# EAGLE design pumpkin (EAGLE 5.09)
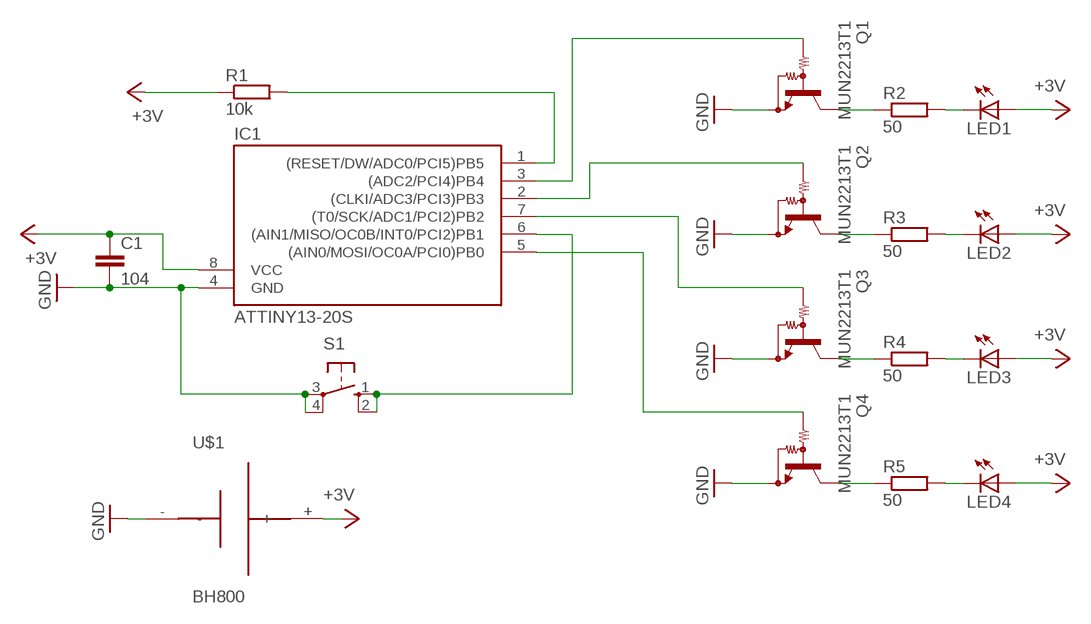
[diagram p0: schematic, sheet 1]

## Parts
C1  104  C-EUC2012  [C2012]
IC1  ATTINY13-20S  [SOIC8]
LED1  LED3MM  [LED3MM]
LED2  LED3MM  [LED3MM]
LED3  LED3MM  [LED3MM]
LED4  LED3MM  [LED3MM]
Q1  MUN2213T1  [SC59-BEC]
Q2  MUN2213T1  [SC59-BEC]
Q3  MUN2213T1  [SC59-BEC]
Q4  MUN2213T1  [SC59-BEC]
R1  10k  R-EU_0204/5  [0204/5]
R2  50  R-EU_0204/5  [0204/5]
R3  50  R-EU_0204/5  [0204/5]
R4  50  R-EU_0204/5  [0204/5]
R5  50  R-EU_0204/5  [0204/5]
S1  10-XX  [B3F-10XX]
U$1  BH800  [BH800]

## Nets
+5V: C1.1 IC1.8(VCC) LED1.A LED2.A LED3.A LED4.A R1.1 U$1.+ ; supply symbol labelled +3V
GND: C1.2 IC1.4(GND) Q1.E Q2.E Q3.E Q4.E S1.3(P) S1.4(P1) U$1.-
N$1: Q1.C R2.1
N$2: Q2.C R3.1
N$3: Q3.C R4.1
N$4: Q4.C R5.1
N$5: IC1.3((ADC2/PCI4)PB4) Q1.B
N$6: LED1.K(C) R2.2
N$7: IC1.2((CLKI/ADC3/PCI3)PB3) Q2.B
N$8: LED2.K(C) R3.2
N$9: LED3.K(C) R4.2
N$10: IC1.1((RESET/DW/ADC0/PCI5)PB5) R1.2
N$11: LED4.K(C) R5.2
N$12: IC1.7((T0/SCK/ADC1/PCI2)PB2) Q3.B
N$13: IC1.5((AIN0/MOSI/OC0A/PCI0)PB0) Q4.B
N$14: IC1.6((AIN1/MISO/OC0B/INT0/PCI2)PB1) S1.1(S) S1.2(S1)

## Library data of the parts
C1 = rcl:C-EU: CAPACITOR, European symbol
IC1 = avr:ATTINY13: MICROCONTROLLER 1 Kbytes FLASH 64 bytes EEPROM 64 bytes RAM 4-channel 10 bit ADC
LED1-LED4 = led:LED: LED OSRAM: - CHIPLED LG R971, LG N971, LY N971, LG Q971, LY Q971, LO R971, LY R971 LH N974, LH R974 LS Q976, LO Q976, LY Q976 LO Q996 - Hyper CHIPLED LW Q18S LB Q993, LB Q99A, LB R99A - SideLED LS A670, LO A670, LY A670, LG A670, LP A670 LB A673, LV A673, LT A673, LW A673 LH A674 LY A675 LS A676, LA A676, LO A676, LY A676, LW A676 LS A679, LY A679, LG A679 - Hyper Micro SIDELED® LS Y876, LA Y876, LO Y876, LY Y876 LT Y87S - SmartLED LW L88C, LW L88S LB L89C, LB L89S, LG L890 LS L89K, LO L89K, LY L89K LS L896, LA L896, LO L896, LY L896 - TOPLED LS T670, LO T670, LY T670, LG T670, LP T670 LSG T670, LSP T670, LSY T670, LOP T670, LYG T670 LG T671, LOG T671, LSG T671 LB T673, LV T673, LT T673, LW T673 LH T674 LS T676, LA T676, LO T676, LY T676, LB T676, LH T676, LSB T676, LW T676 LB T67C, LV T67C, LT T67C, LS T67K, LO T67K, LY T67K, LW E67C LS E67B, LA E67B, LO E67B, LY E67B, LB E67C, LV E67C, LT E67C LW T67C LS T679, LY T679, LG T679 LS T770, LO T770, LY T770, LG T770, LP T770 LB T773, LV T773, LT T773, LW T773 LH T774 LS E675, LA E675, LY E675, LS T675 LS T776, LA T776, LO T776, LY T776, LB T776 LHGB T686 LT T68C, LB T68C - Hyper Mini TOPLED® LB M676 - Mini TOPLED Santana® LG M470 LS M47K, LO M47K, LY M47K Source: http://www.osram.convergy.de LUXEON: - LUMILED® LXK2-PW12-R00, LXK2-PW12-S00, LXK2-PW14-U00, LXK2-PW14-V00 LXK2-PM12-R00, LXK2-PM12-S00, LXK2-PM14-U00 LXK2-PE12-Q00, LXK2-PE12-R00, LXK2-PE12-S00, LXK2-PE14-T00, LXK2-PE14-U00 LXK2-PB12-K00, LXK2-PB12-L00, LXK2-PB12-M00, LXK2-PB14-N00, LXK2-PB14-P00, LXK2-PB14-Q00 LXK2-PR12-L00, LXK2-PR12-M00, LXK2-PR14-Q00, LXK2-PR14-R00 LXK2-PD12-Q00, LXK2-PD12-R00, LXK2-PD12-S00 LXK2-PH12-R00, LXK2-PH12-S00 LXK2-PL12-P00, LXK2-PL12-Q00, LXK2-PL12-R00 Source: www.luxeon.com KINGBRIGHT: KA-3528ASYC Source: www.kingbright.com
Q1-Q4 = transistor-npn:MUN2213*: NPN Bias Resistor Transistor
R1-R5 = resistor:R-EU_: RESISTOR, European symbol
S1 = switch-omron:10-XX: OMRON SWITCH
U$1 = daines_parts:BH800: Battery holder for a coin battery (CR2032, CR2025, CR2016, LIR2025)

## Board
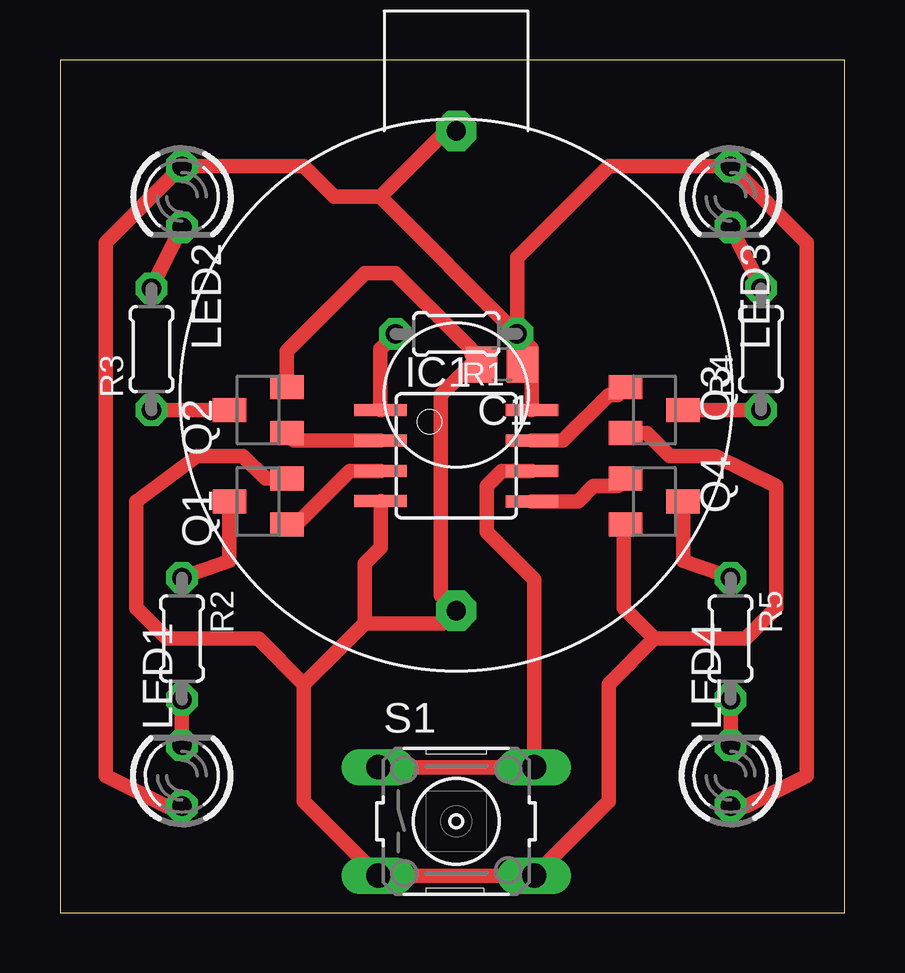
[diagram p1: board, top side]

Size 32.69 x 35.55 mm. Coordinates in mm from the lower left corner, seen from the top.
Outline: 0,0 32.69,0 32.69,35.55 0,35.55 0,0
Copper layers (1*16): Top 0.035mm / dielectric 1.5mm / Bottom 0.035mm
Design rules "default": minimum track width 10mil, minimum drill 24mil, track to track 8mil, track to pad 8mil, pad to pad 8mil, via to via 8mil, smd to smd 8mil, copper to edge 40mil, drill to drill 8mil, minimum pad ring 10mil, minimum via ring 8mil, stop-mask expansion 4mil, vias tented up to drill 0mil, thermal gap 10mil

### Footprints (pad centres in the part's own frame; a part is rotated, then mirrored left to right if it is on the bottom)
C2012 = smd 1.3 x 1.5: 1 -0.85,0; 2 0.85,0
SOIC8 = smd 0.5 x 2.2: 1 -1.905,-3.154; 2 -0.645,-3.154; 3 0.625,-3.154; 4 1.895,-3.154; 5 1.905,3.154; 6 0.635,3.154; 7 -0.635,3.154; 8 -1.905,3.154
LED3MM = drill 0.813 octagon: A -1.27,0; K 1.27,0
SC59-BEC = smd 1 x 1.4: B -0.95,-1.2; C 0,1.2; E 0.95,-1.2
0204/5 = drill 0.813 octagon: 1 -2.54,0; 2 2.54,0
B3F-10XX = drill 1.016 long: 1 -3.251,2.261; 2 3.251,2.261; 3 -3.251,-2.261; 4 3.251,-2.261
BH800 = drill 0.8 pad 1.676 octagon: + 0,-11; - 0,9

### Placement (x,y rotation side)
C1  18.42,22.86 180 top
IC1  16.51,19.05 270 top
LED1  5.08,5.71 90 top
LED2  5.08,29.84 270 top
LED3  27.94,29.84 270 top
LED4  27.94,5.71 90 top
Q1  8.25,17.14 90 top
Q2  8.25,20.96 90 top
Q3  24.76,20.96 270 top
Q4  24.76,17.14 270 top
R1  16.51,24.13 180 top
R2  5.08,11.43 270 top
R3  3.81,23.5 90 top
R4  29.21,23.5 90 top
R5  27.94,11.43 270 top
S1  16.51,3.81 0 top
U$1  16.51,21.59 180 top

### Tracks (layer width: path | path; a pad name or v marks a point on that pad's centre or on a via)
+5V
  Top 0.406: 19.66,22.86 C1.1
  Top 0.61: IC1.8 19.66,22.86 19.66,23.52 R1.1 | R1.1 19.05,27.3 22.86,31.11 LED3.A 31.11,27.94 31.11,5.71 28.57,4.44 LED4.A | 13.33,29.84 R1.1 | 13.33,29.84 11.43,29.84 10.16,31.11 LED2.A 1.9,27.94 1.9,5.71 4.44,4.44 LED1.A | U$1.+ 16.08,32.59 13.33,29.84
GND
  Top 0.61: Q4.E 23.5,16.12 23.5,12.7 24.76,11.43 | Q3.E 24.44,20 25.4,19.05 27.3,19.05 29.85,17.78 29.85,12.7 28.57,11.43 24.76,11.43 | 10.16,9.52 12.7,12.06 | IC1.4 13.36,15.22 12.7,14.56 12.7,12.06 | 24.76,11.43 22.86,9.52 22.86,4.65 S1.4 S1.3 10.16,4.65 10.16,9.52 | Q1.E 8.57,18.09 7.62,19.05 5.71,19.05 3.18,17.14 3.18,12.7 4.44,11.43 8.25,11.43 10.16,9.52 | 12.7,12.06 15.99,12.06 U$1.- 15.87,13.22 15.87,21.59 17.14,22.86 C1.2 17.14,23.28 17.14,23.5 13.97,26.67 12.7,26.67 9.46,23.43 Q2.E
N$1
  Top 0.61: Q1.C 7.05,14.67 R2.1
N$2
  Top 0.61: R3.1 Q2.C
N$3
  Top 0.61: R4.1 Q3.C
N$4
  Top 0.61: Q4.C 25.96,14.67 R5.1
N$5
  Top 0.61: Q1.B 9.85,16.19 12.07,18.41 13.35,18.41 IC1.3
N$6
  Top 0.61: R2.2 LED1.K
N$7
  Top 0.61: IC1.2 9.76,19.69 Q2.B
N$8
  Top 0.61: R3.2 LED2.K
N$9
  Top 0.61: R4.2 LED3.K
N$10
  Top 0.61: R1.2 13.33,23.5 13.33,20.98 IC1.1
N$11
  Top 0.61: R5.2 LED4.K
N$12
  Top 0.61: IC1.7 20.96,19.68 22.86,21.59 23.25,21.59 Q3.B
N$13
  Top 0.61: IC1.5 21.59,17.14 22.22,17.78 23.25,17.78 Q4.B
N$14
  Top 0.61: IC1.6 18.42,18.41 17.78,17.78 17.78,15.87 19.76,13.89 S1.2 S1.1